# Altium schematic sheet CH32H417QEU6-R0.SchDoc
size 457 x 287 mm; SheetNumber: 0; SheetTotal: 0
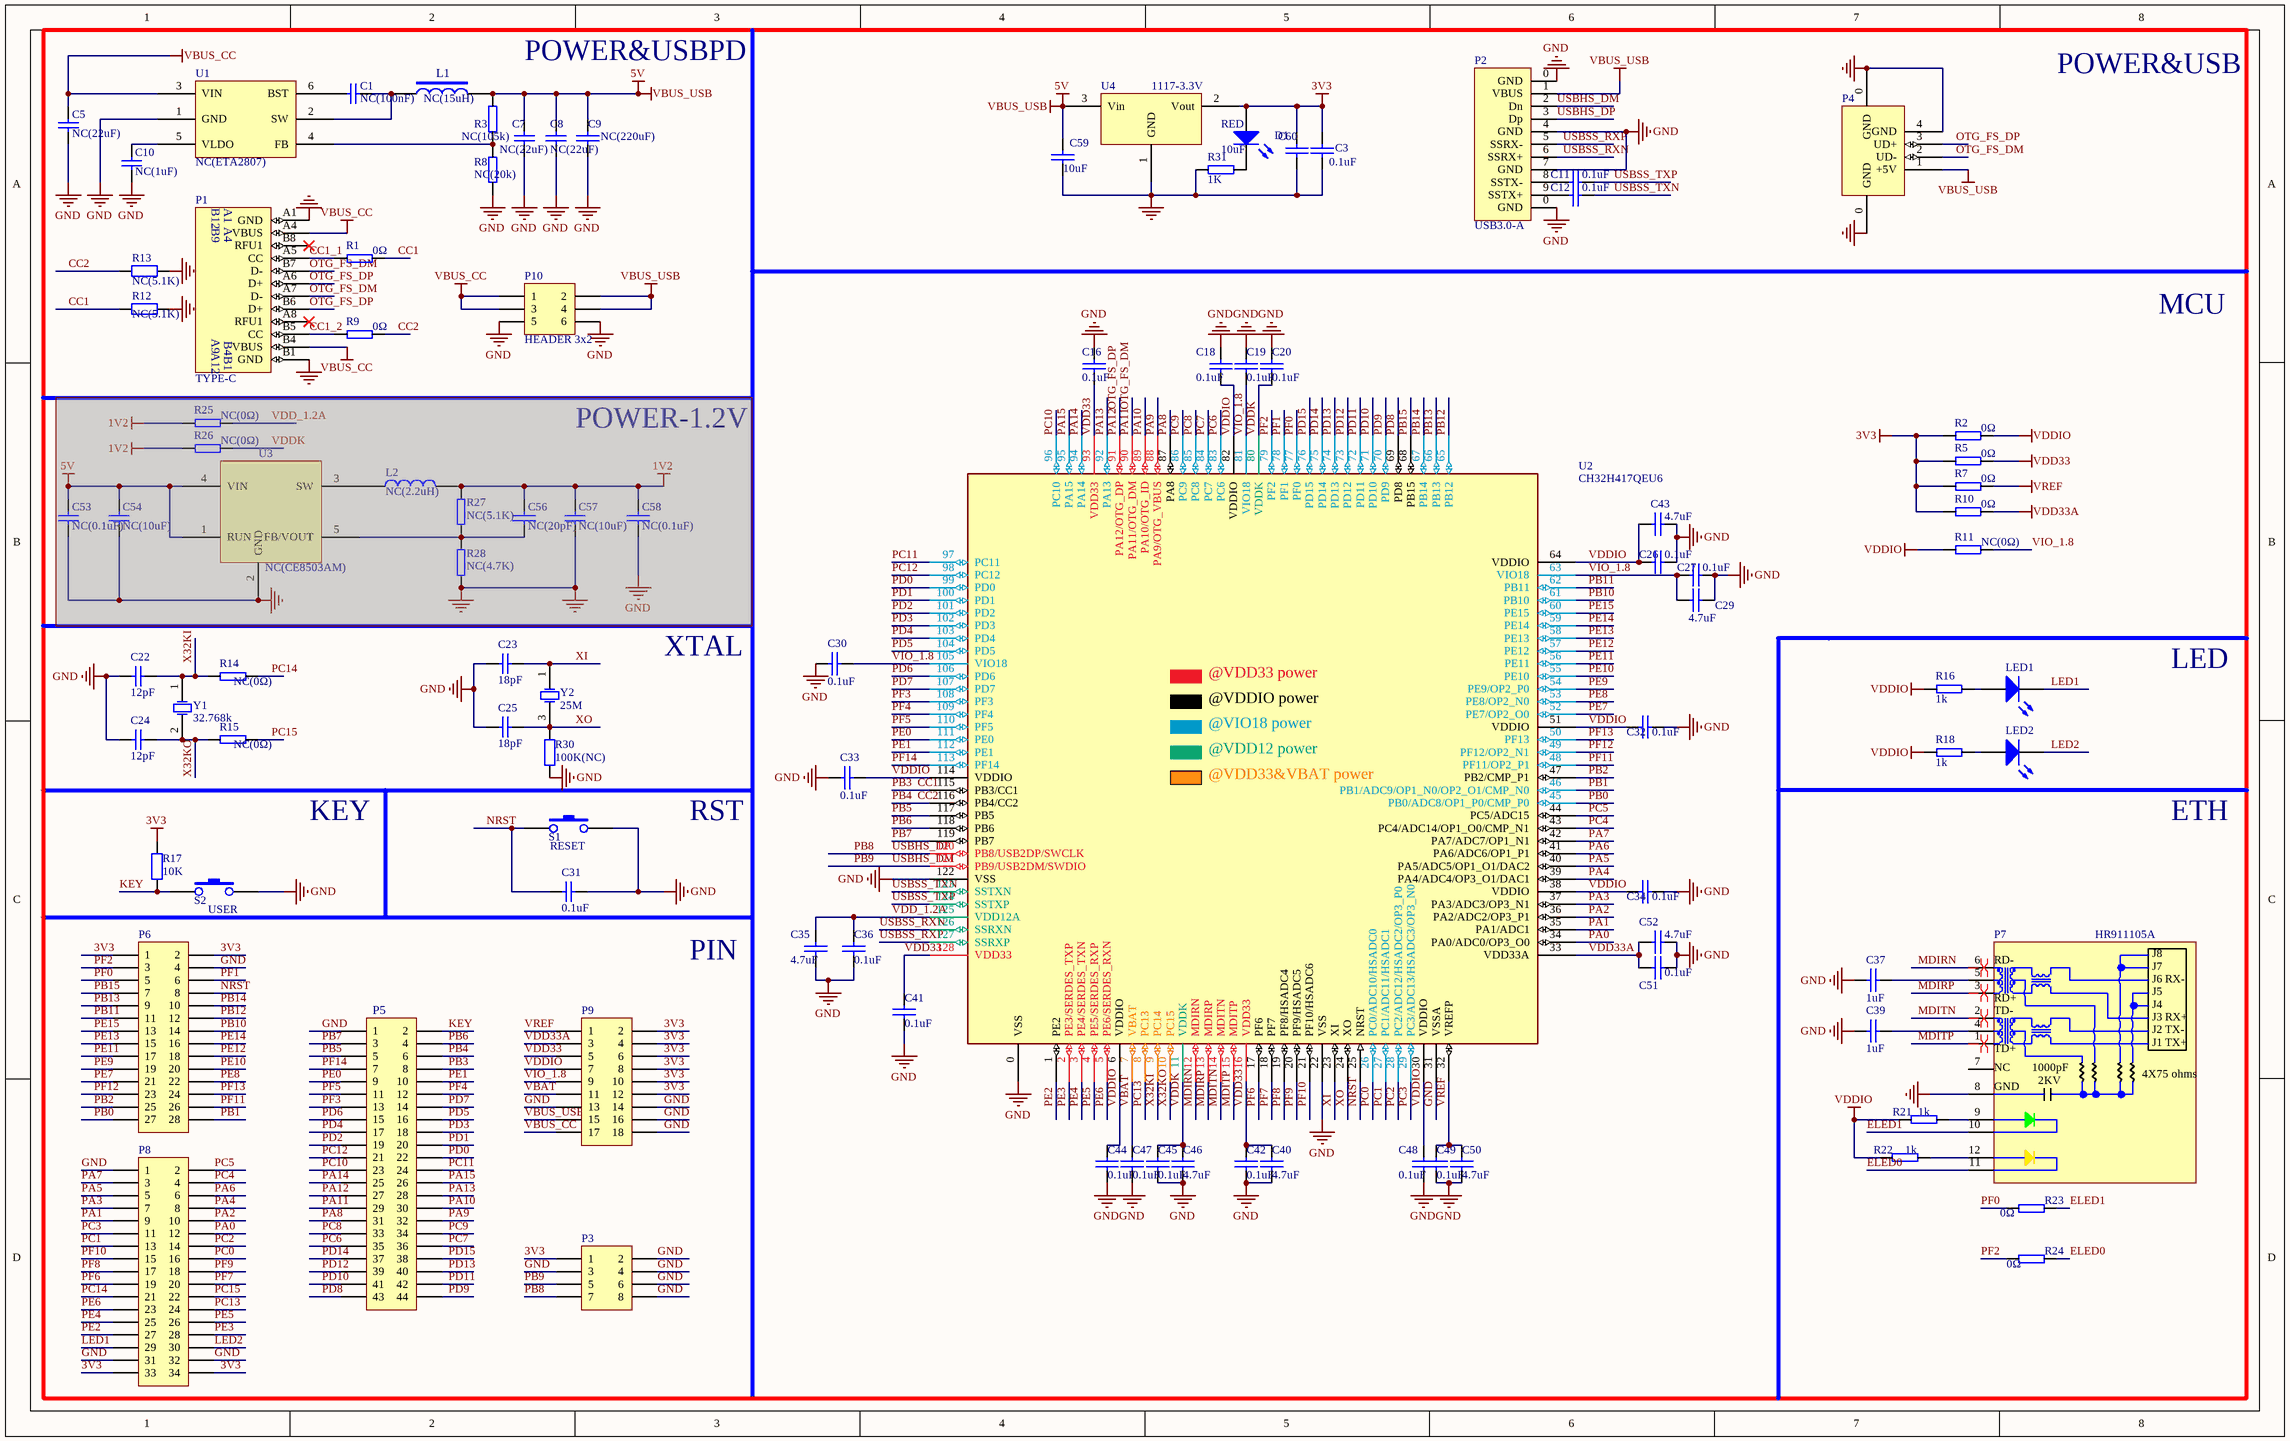
[diagram p0: CH32H417QEU6-R0.SchDoc]

## Parts
C1  NC(100nF)  [0402_C]
C3  0.1uF  [0402_C]
C5  NC(22uF)  [0805_C]
C7  NC(22uF)  [0805_C]
C8  NC(22uF)  [0805_C]
C9  NC(220uF)  [CD0.1]
C10  NC(1uF)  [0402_C]
C11  0.1uF  [0402_C]
C12  0.1uF  [0402_C]
C16  0.1uF  [0402_C]
C18  0.1uF  [0402_C]
C19  0.1uF  [0402_C]
C20  0.1uF  [0402_C]
C22  12pF  [0603_C]
C23  18pF  [0402_C]
C24  12pF  [0603_C]
C25  18pF  [0402_C]
C26  0.1uF  [0402_C]
C27  0.1uF  [0402_C]
C29  4.7uF  [0402_C]
C30  0.1uF  [0402_C]
C31  0.1uF  [0402_C]
C32  0.1uF  [0402_C]
C33  0.1uF  [0402_C]
C34  0.1uF  [0402_C]
C35  4.7uF  [0402_C]
C36  0.1uF  [0402_C]
C37  1uF  [0402_C]
C39  1uF  [0402_C]
C40  4.7uF  [0402_C]
C41  0.1uF  [0402_C]
C42  0.1uF  [0402_C]
C43  4.7uF  [0402_C]
C44  0.1uF  [0402_C]
C45  0.1uF  [0402_C]
C46  4.7uF  [0402_C]
C47  0.1uF  [0402_C]
C48  0.1uF  [0402_C]
C49  0.1uF  [0402_C]
C50  4.7uF  [0402_C]
C51  0.1uF  [0402_C]
C52  4.7uF  [0402_C]
C53  NC(0.1uF)  [0402_C]  (masked out: inside a compile mask, not in the netlist)
C54  NC(10uF)  [0603_C]  (masked out: inside a compile mask, not in the netlist)
C56  NC(20pF)  [0402_C]  (masked out: inside a compile mask, not in the netlist)
C57  NC(10uF)  [0603_C]  (masked out: inside a compile mask, not in the netlist)
C58  NC(0.1uF)  [0402_C]  (masked out: inside a compile mask, not in the netlist)
C59  10uF  [0603_C]
C60  10uF  [0603_C]
D1  RED  [0603+]
L1  NC(15uH)  [SMD_6x6mm]
L2  NC(2.2uH)  [CD32]  (masked out: inside a compile mask, not in the netlist)
LED1  LED2  blue  [0603+]  (value not drawn)
LED2  LED1   blue  [0603+]  (value not drawn)
P1  TYPE-C  [TYPE-C-Receptacle-2.0]
P2  USB3.0-A  [USB3.0-A-Receptacle]
P3  HEADER 4x2  [IDC8-2.54mm]  (value not drawn)
P4  USB_A  [USBAF]  (value not drawn)
P5  (no value)  [IDC44-2.54MM]
P6  HEADER 14x2  [IDC28-2.54MM]  (value not drawn)
P7  HR911105A  [HR911105A]
P8  HEADER 17x2  [IDC34-2.54MM]  (value not drawn)
P9  HEADER 9x2  [IDC18-2.54MM]  (value not drawn)
P10  HEADER 3x2  [IDC6-2.54mm]
R1  0Ω  [0402]
R2  0Ω  [0402]
R3  NC(105k)  [0402]
R5  0Ω  [0402]
R7  0Ω  [0402]
R8  NC(20k)  [0402]
R9  0Ω  [0402]
R10  0Ω  [0402]
R11  NC(0Ω)  [0402]
R12  NC(5.1K)  [0402]
R13  NC(5.1K)  [0402]
R14  NC(0Ω)  [0402]
R15  NC(0Ω)  [0402]
R16  1k  [0402]
R17  10K  [0402]
R18  1k  [0402]
R21  1k  [0402]
R22  1k  [0402]
R23  0Ω  [0402]
R24  0Ω  [0402]
R25  NC(0Ω)  [0402]  (masked out: inside a compile mask, not in the netlist)
R26  NC(0Ω)  [0402]  (masked out: inside a compile mask, not in the netlist)
R27  NC(5.1K)  [0402]  (masked out: inside a compile mask, not in the netlist)
R28  NC(4.7K)  [0402]  (masked out: inside a compile mask, not in the netlist)
R30  100K(NC)  [0402]
R31  1K  [0402]
S1  RESET  [SMD_6.1x3.65x2.5mm-KEY]
S2  USER  [SMD_6.1x3.65x2.5mm-KEY]
U1  NC(ETA2807)  [SOT-23-6]
U2  CH32H417QEU6  [QFN128_12.3X12.3]
U3  NC(CE8503AM)  [SOT-23-5]  (masked out: inside a compile mask, not in the netlist)
U4  1117-3.3V  [SOT-223]
Y1  32.768k  [FC-135]
Y2  25M  [XT3225]

## Nets
3V3: C3.1 C60.1 D1.1(A) P3.1 P6.1 P6.2 P8.33 P8.34 P9.2 P9.4 P9.6 P9.8 P9.10 P9.12 R2.2 R5.2 R7.2 R10.2 R17.1 U4.2(Vout)
GND: C3.2 C5.1 C7.1 C8.1 C9.2 C10.1 C16.2 C18.2 C19.2 C20.2 C22.2 C23.1 C24.2 C25.1 C26.2 C27.2 C29.1 C30.2 C31.1 C32.2 C33.1 C34.1 C35.1 C36.1 C37.1 C39.1 C40.1 C41.1 C42.1 C43.1 C44.1 C45.1 C46.2 C47.1 C48.2 C49.1 C50.2 C51.1 C52.2 C59.2 C60.2 P1.A1(GND) P1.B1(GND) P2.0(GND) P2.4(GND) P2.7(GND) P3.2 P3.3 P3.4 P3.6 P3.8 P4.0(GND) P4.4(GND) P5.1 P6.4 P7.8 P8.1 P8.31 P8.32 P9.13 P9.14 P9.16 P9.18 P10.5 P10.6 R8.1 R12.2 R13.2 R30.1 R31.1 S1.2 S2.2 U1.1(GND) U2.0(VSS) U2.22(VSS) U2.31(VSSA) U2.122(VSS) U4.1(GND)
VBUS_CC: C5.2 P1.A4(VBUS) P1.B4(VBUS) P9.17 P10.1 P10.3 U1.3(VIN)
VBUS_USB: C7.2 C8.2 C9.1 C59.1 L1.2 P2.1(VBUS) P4.1(+5V) P9.15 P10.2 P10.4 R3.2 U4.3(Vin)  [also labelled 5V]
VDD33: C16.1 C40.2 C41.2 C42.2 P9.5 R5.1 U2.16(VDD33) U2.93(VDD33) U2.128(VDD33)
VDD33A: C51.2 C52.1 P9.3 R10.1 U2.33(VDD33A)
VDDIO: C18.1 C26.1 C32.1 C33.2 C34.2 C43.2 C44.2 C48.1 P9.7 R2.1 R11.2 R16.1 R18.1 R21.1 R22.1 U2.6(VDDIO) U2.30(VDDIO) U2.38(VDDIO) U2.51(VDDIO) U2.64(VDDIO) U2.82(VDDIO) U2.114(VDDIO)
VREF: C49.2 C50.1 P9.1 R7.1 U2.32(VREFP)
CC1: P5.8 R1.1 R12.1 U2.115(PB3/CC1)  [also labelled PB3]
CC1_1: P1.A5(CC) R1.2
CC1_2: P1.B5(CC) R9.2
CC2: P5.6 R9.1 R13.1 U2.116(PB4/CC2)  [also labelled PB4]
ELED0: P7.11 R24.2
ELED1: P7.10 R23.2
KEY: P5.2 R17.2 S2.1
LED1: LED1.2(K) P8.29
LED2: LED2.2(K) P8.30
MDIRN: P7.6 U2.12(MDIRN)
MDIRP: P7.3 U2.13(MDIRP)
MDITN: P7.2 U2.14(MDITN)
MDITP: P7.1 U2.15(MDITP)
NRST: C31.2 P6.8 S1.1 U2.25(NRST)
OTG_FS_DM: P1.A7(D-) P1.B7(D-) P4.2(UD-) P5.29 U2.90(PA11/OTG_DM)  [also labelled PA11]
OTG_FS_DP: P1.A6(D+) P1.B6(D+) P4.3(UD+) P5.27 U2.91(PA12/OTG_DP)  [also labelled PA12]
PA0: P8.12 U2.34(PA0/ADC0/OP3_O0)
PA1: P8.9 U2.35(PA1/ADC1)
PA2: P8.10 U2.36(PA2/ADC2/OP3_P1)
PA3: P8.7 U2.37(PA3/ADC3/OP3_N1)
PA4: P8.8 U2.39(PA4/ADC4/OP3_O1/DAC1)
PA5: P8.5 U2.40(PA5/ADC5/OP1_O1/DAC2)
PA6: P8.6 U2.41(PA6/ADC6/OP1_P1)
PA7: P8.3 U2.42(PA7/ADC7/OP1_N1)
PA8: P5.31 U2.87(PA8)
PA9: P5.32 U2.88(PA9/OTG_VBUS)
PA10: P5.30 U2.89(PA10/OTG_ID)
PA13: P5.28 U2.92(PA13)
PA14: P5.25 U2.94(PA14)
PA15: P5.26 U2.95(PA15)
PB0: P6.27 U2.45(PB0/ADC8/OP1_P0/CMP_P0)
PB1: P6.28 U2.46(PB1/ADC9/OP1_N0/OP2_O1/CMP_N0)
PB2: P6.25 U2.47(PB2/CMP_P1)
PB5: P5.5 U2.117(PB5)
PB6: P5.4 U2.118(PB6)
PB7: P5.3 U2.119(PB7)
PB8: P2.3(Dp) P3.7 U2.120(PB8/USB2DP/SWCLK)  [also labelled USBHS_DP]
PB9: P2.2(Dn) P3.5 U2.121(PB9/USB2DM/SWDIO)  [also labelled USBHS_DM]
PB10: P6.14 U2.61(PB10)
PB11: P6.11 U2.62(PB11)
PB12: P6.12 U2.65(PB12)
PB13: P6.9 U2.66(PB13)
PB14: P6.10 U2.67(PB14)
PB15: P6.7 U2.68(PB15)
PC0: P8.16 U2.26(PC0/ADC10/HSADC0)
PC1: P8.13 U2.27(PC1/ADC11/HSADC1)
PC2: P8.14 U2.28(PC2/ADC12/HSADC2/OP3_P0)
PC3: P8.11 U2.29(PC3/ADC13/HSADC3/OP3_N0)
PC4: P8.4 U2.43(PC4/ADC14/OP1_O0/CMP_N1)
PC5: P8.2 U2.44(PC5/ADC15)
PC6: P5.35 U2.83(PC6)
PC7: P5.36 U2.84(PC7)
PC8: P5.33 U2.85(PC8)
PC9: P5.34 U2.86(PC9)
PC10: P5.23 U2.96(PC10)
PC11: P5.24 U2.97(PC11)
PC12: P5.21 U2.98(PC12)
PC13: P8.24 U2.8(PC13)
PC14: P8.21 R14.1
PC15: P8.22 R15.1
PD0: P5.22 U2.99(PD0)
PD1: P5.20 U2.100(PD1)
PD2: P5.19 U2.101(PD2)
PD3: P5.18 U2.102(PD3)
PD4: P5.17 U2.103(PD4)
PD5: P5.16 U2.104(PD5)
PD6: P5.15 U2.106(PD6)
PD7: P5.14 U2.107(PD7)
PD8: P5.43 U2.69(PD8)
PD9: P5.44 U2.70(PD9)
PD10: P5.41 U2.71(PD10)
PD11: P5.42 U2.72(PD11)
PD12: P5.39 U2.73(PD12)
PD13: P5.40 U2.74(PD13)
PD14: P5.37 U2.75(PD14)
PD15: P5.38 U2.76(PD15)
PE0: P5.9 U2.111(PE0)
PE1: P5.10 U2.112(PE1)
PE2: P8.27 U2.1(PE2)
PE3: P8.28 U2.2(PE3/SERDES_TXP)
PE4: P8.25 U2.3(PE4/SERDES_TXN)
PE5: P8.26 U2.4(PE5/SERDES_RXP)
PE6: P8.23 U2.5(PE6/SERDES_RXN)
PE7: P6.21 U2.52(PE7/OP2_O0)
PE8: P6.22 U2.53(PE8/OP2_N0)
PE9: P6.19 U2.54(PE9/OP2_P0)
PE10: P6.20 U2.55(PE10)
PE11: P6.17 U2.56(PE11)
PE12: P6.18 U2.57(PE12)
PE13: P6.15 U2.58(PE13)
PE14: P6.16 U2.59(PE14)
PE15: P6.13 U2.60(PE15)
PF0: P6.5 R23.1 U2.77(PF0)
PF1: P6.6 U2.78(PF1)
PF2: P6.3 R24.1 U2.79(PF2)
PF3: P5.13 U2.108(PF3)
PF4: P5.12 U2.109(PF4)
PF5: P5.11 U2.110(PF5)
PF6: P8.19 U2.17(PF6)
PF7: P8.20 U2.18(PF7)
PF8: P8.17 U2.19(PF8/HSADC4)
PF9: P8.18 U2.20(PF9/HSADC5)
PF10: P8.15 U2.21(PF10/HSADC6)
PF11: P6.26 U2.48(PF11/OP2_P1)
PF12: P6.23 U2.49(PF12/OP2_N1)
PF13: P6.24 U2.50(PF13)
PF14: P5.7 U2.113(PF14)
USBSS_RXN: P2.6(SSRX+) U2.126(SSRXN)
USBSS_RXP: P2.5(SSRX-) U2.127(SSRXP)
USBSS_TXN: C12.2 U2.123(SSTXN)
USBSS_TXP: C11.2 U2.124(SSTXP)
VBAT: C47.2 P9.11 U2.7(VBAT)
VDD_1.2A: C35.2 C36.2 U2.125(VDD12A)
VDDK: C20.1 C45.2 C46.1 U2.11(VDDK) U2.80(VDDK)
VIO_1.8: C19.1 C27.1 C29.2 C30.1 P9.9 R11.1 U2.63(VIO18) U2.81(VIO18) U2.105(VIO18)
X32KI: C22.1 R14.2 U2.9(PC14) Y1.1(OSC1)
X32KO: C24.1 R15.2 U2.10(PC15) Y1.2(OSC2)
XI: C23.2 U2.23(XI) Y2.1(OSC1)
XO: C25.2 R30.2 U2.24(XO) Y2.3(OSC2)
NetC1_1: C1.1 L1.1 U1.2(SW)
NetC1_2: C1.2 U1.6(BST)
NetC10_2: C10.2 U1.5(VLDO)
NetC11_1: C11.1 P2.8(SSTX-)
NetC12_1: C12.1 P2.9(SSTX+)
NetC37_2: C37.2 P7.5
NetC39_2: C39.2 P7.4
NetD1_2: D1.2(K) R31.2
NetLED1_1: LED1.1(A) R16.2
NetLED2_1: LED2.1(A) R18.2
NetP7_9: P7.9 R21.2
NetP7_12: P7.12 R22.2
NetR3_1: R3.1 R8.2 U1.4(FB)

Not connected (* = marked no-connect by the designer): P1 A8(RFU1)* B8(RFU1)*; P7 7

## Layout directives
differential pair: MDIRN, MDIRP, MDITN, MDITP

## Notes on the sheet
- POWER&USBPD
- POWER&USB
- MCU
- POWER-1.2V
- (near U3) Hot!!!
- XTAL
- LED
- KEY
- RST
- ETH
- PIN
- Title
- Size:
- Date:
- A3
- Number:
- Time:
- Revision:
- Sheet
- of
- File:
- (in symbol CH32H417QET6) @VDD33 power; @VDDIO power; @VIO18 power; @VDD12 power; @VDD33&VBAT power
- (in symbol HR911105A) J8; RD-; J7; J6; RX-; J5; RD+; J4; TD-; J3; RX+; J2; TX-; J1; TX+; TD+; NC; 1000pF; 4X75 ohms; 2KV; GND
- (in symbol TYPE-C1) B12; B9; A9; A12

## Library data of the parts
C1 C5 C7 C8 C10 = 0603 100nF (104) 10% 50V: 贴片电容; ComponentLink1Description: 供应商链接; ComponentLink1URL: http://www.szlcsc.com/product/details_15331.html; Package: 0603; Supplier: LC; SuppliersPartNumber: C14663
C3 C9 C11 C12 C16 C18-C20 C26 C27 C29 C30 C32-C37 C39-C52 C56 C58-C60 = CAP: Capacitor
C22-C25 C31 C53 C54 C57 = Cap: Capacitor
  C53 C54 C57: Published: 8-Jun-2000; LatestRevisionDate: 17-Jul-2002; LatestRevisionNote: Re-released for DXP Platform.; PackageReference: RAD-0.3; Publisher: Altium Limited; PackageDescription: Radial Cap, Thru-Hole; 2 Leads; 0.3 in Pin Spacing
D1 LED1 LED2 = LED0: Typical INFRARED GaAs LED; Published: 8-Jun-2000; LatestRevisionDate: 08-Jul-2005; LatestRevisionNote: Mech Layer 1 removed.; PackageReference: LED-0; Publisher: Altium Limited
  D1: PackageDescription: LED; 2 Leads
L1 L2 = INDUCTOR
P1 = TYPE-C1
P3 = HEADER 4x2: Header, 4-Pin, Dual row
P4 = USB: USB Port
P5 = HEADER 22x2: Header, 22-Pin, Dual row
P6 = HEADER 14x2: Header, 14-Pin, Dual row
P8 = HEADER 17x2: Header, 17-Pin, Dual row
P9 = HEADER 9x2: Header, 9-Pin, Dual row
P10 = HEADER 3x2: Header, 3-Pin, Dual row
R1-R3 R5 R7-R11 R14-R16 R18 R21-R26 R31 = RES
R12 R13 R17 R30 = Res2: Resistor
R27 R28 = R
S1 S2 = KEY1
U1 = TPS54202: 5~28V输入，DCDC
U2 = CH32H417QET6: RISC-V FPU HD-MCU, 384MHz, USB3.0 & PD, 100M Ethernet, DVP, SDMMC, QSPI, OPA, ADC, DAC
U3 = FP6160
Y1 Y2 = XTAL: Crystal Oscillator; Published: 8-Jun-2000; LatestRevisionDate: 17-Jul-2002; LatestRevisionNote: Re-released for DXP Platform.; PackageReference: R38; Publisher: Altium Limited